# EAGLE schematic Main&MotorBoard_v3 (EAGLE 9.7.0)

## Sheet 1 of 3: Cover
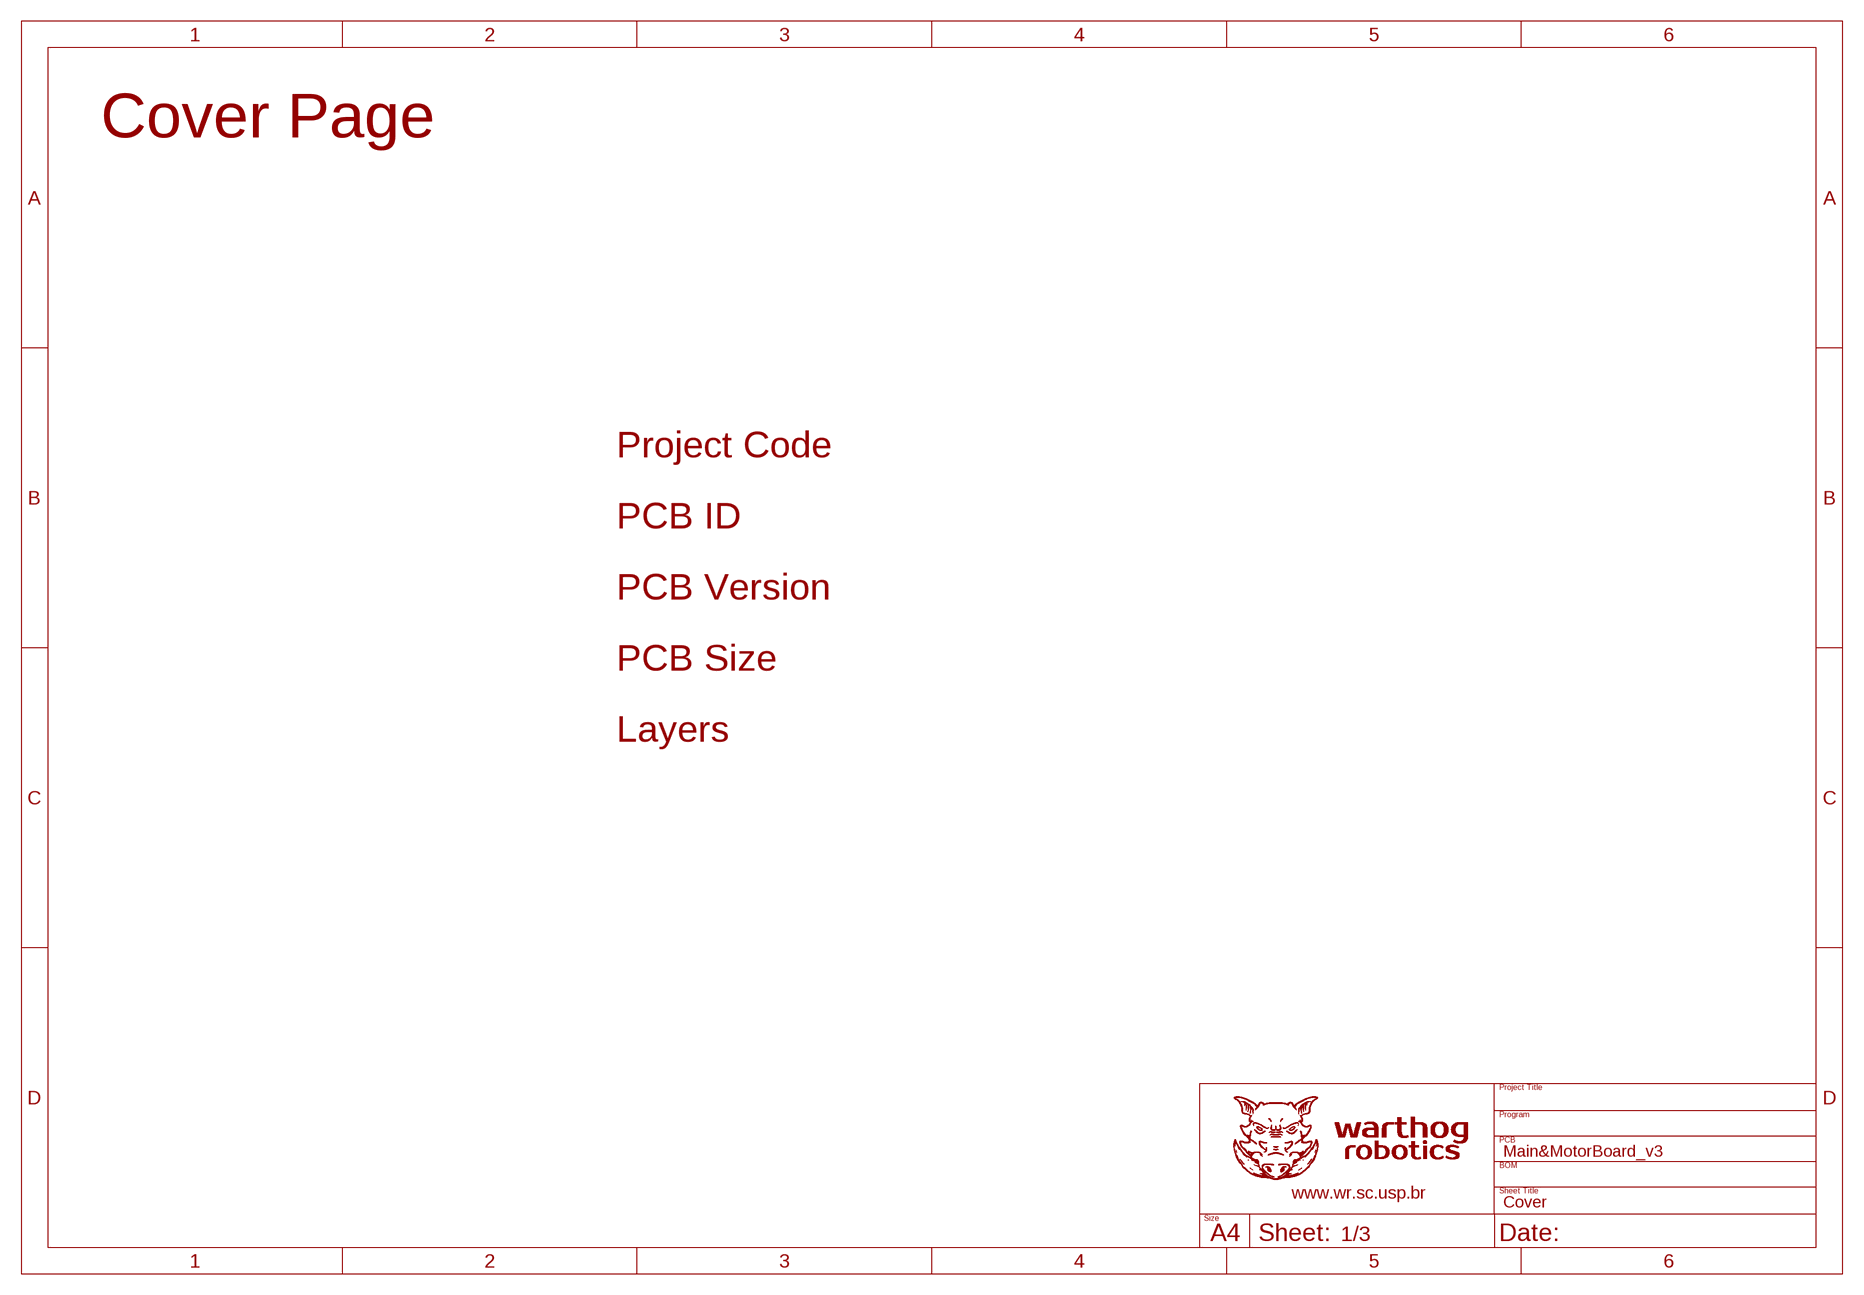
[diagram p0: schematic, sheet 1]

## Sheet 2 of 3: Motor Driver
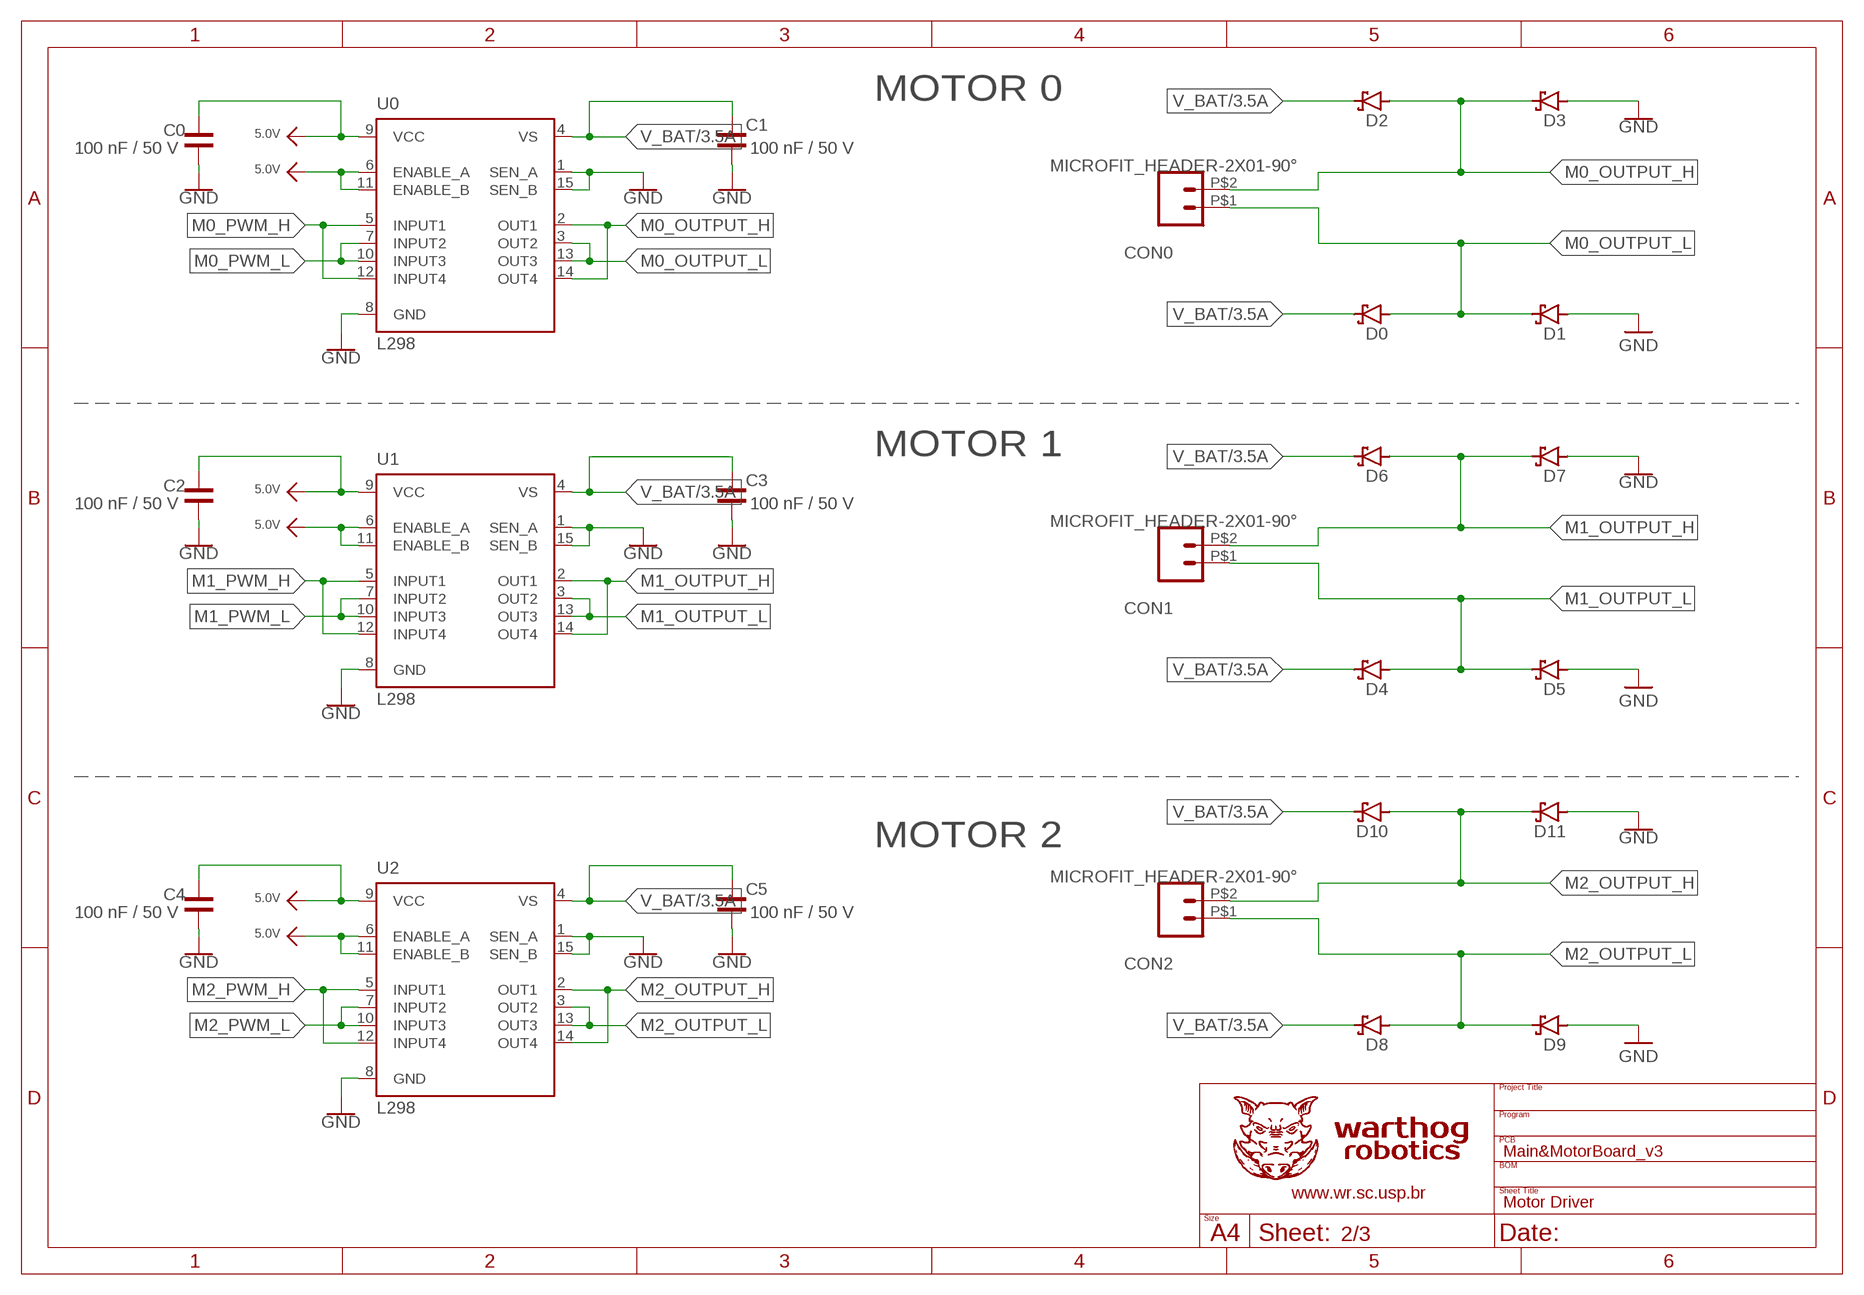
[diagram p1: schematic, sheet 2]

### Parts
C0  100 nF / 50 V  C0805(N)  [C0805(N)]
C1  100 nF / 50 V  C0805(N)  [C0805(N)]
C2  100 nF / 50 V  C0805(N)  [C0805(N)]
C3  100 nF / 50 V  C0805(N)  [C0805(N)]
C4  100 nF / 50 V  C0805(N)  [C0805(N)]
C5  100 nF / 50 V  C0805(N)  [C0805(N)]
CON0  MICROFIT_HEADER-2X01-90°  [2X01-3.00MM-90°]
CON1  MICROFIT_HEADER-2X01-90°  [2X01-3.00MM-90°]
CON2  MICROFIT_HEADER-2X01-90°  [2X01-3.00MM-90°]
D0  1N5406  [DO201-15(N)]
D1  1N5406  [DO201-15(N)]
D2  1N5406  [DO201-15(N)]
D3  1N5406  [DO201-15(N)]
D4  1N5406  [DO201-15(N)]
D5  1N5406  [DO201-15(N)]
D6  1N5406  [DO201-15(N)]
D7  1N5406  [DO201-15(N)]
D8  1N5406  [DO201-15(N)]
D9  1N5406  [DO201-15(N)]
D10  1N5406  [DO201-15(N)]
D11  1N5406  [DO201-15(N)]
U0  L298  [MULTIWATT-15]
U1  L298  [MULTIWATT-15]
U2  L298  [MULTIWATT-15]

### Nets
5.0V: C0.1 C2.1 C4.1 U0.6(ENABLE_A) U0.9(VCC) U0.11(ENABLE_B) U1.6(ENABLE_A) U1.9(VCC) U1.11(ENABLE_B) U2.6(ENABLE_A) U2.9(VCC) U2.11(ENABLE_B) ; also sheet 3
GND: C0.2 C1.2 C2.2 C3.2 C4.2 C5.2 D1.A D3.A D5.A D7.A D9.A D11.A U0.1(SEN_A) U0.8(GND) U0.15(SEN_B) U1.1(SEN_A) U1.8(GND) U1.15(SEN_B) U2.1(SEN_A) U2.8(GND) U2.15(SEN_B) ; also sheet 3
M0_OUTPUT_H: CON0.P$2 D2.A D3.C U0.2(OUT1) U0.14(OUT4)
M0_OUTPUT_L: CON0.P$1 D0.A D1.C U0.3(OUT2) U0.13(OUT3)
M0_PWM_H: U0.5(INPUT1) U0.12(INPUT4)
M0_PWM_L: U0.7(INPUT2) U0.10(INPUT3)
M1_OUTPUT_H: CON1.P$2 D6.A D7.C U1.2(OUT1) U1.14(OUT4)
M1_OUTPUT_L: CON1.P$1 D4.A D5.C U1.3(OUT2) U1.13(OUT3)
M1_PWM_H: U1.5(INPUT1) U1.12(INPUT4)
M1_PWM_L: U1.7(INPUT2) U1.10(INPUT3)
M2_OUTPUT_H: CON2.P$2 D10.A D11.C U2.2(OUT1) U2.14(OUT4)
M2_OUTPUT_L: CON2.P$1 D8.A D9.C U2.3(OUT2) U2.13(OUT3)
M2_PWM_H: U2.5(INPUT1) U2.12(INPUT4)
M2_PWM_L: U2.7(INPUT2) U2.10(INPUT3)
V_BAT: C1.1 C3.1 C5.1 D0.C D2.C D4.C D6.C D8.C D10.C U0.4(VS) U1.4(VS) U2.4(VS) ; also sheet 3

### Notes on the sheet
- MOTOR 0
- MOTOR 1
- MOTOR 2

## Sheet 3 of 3
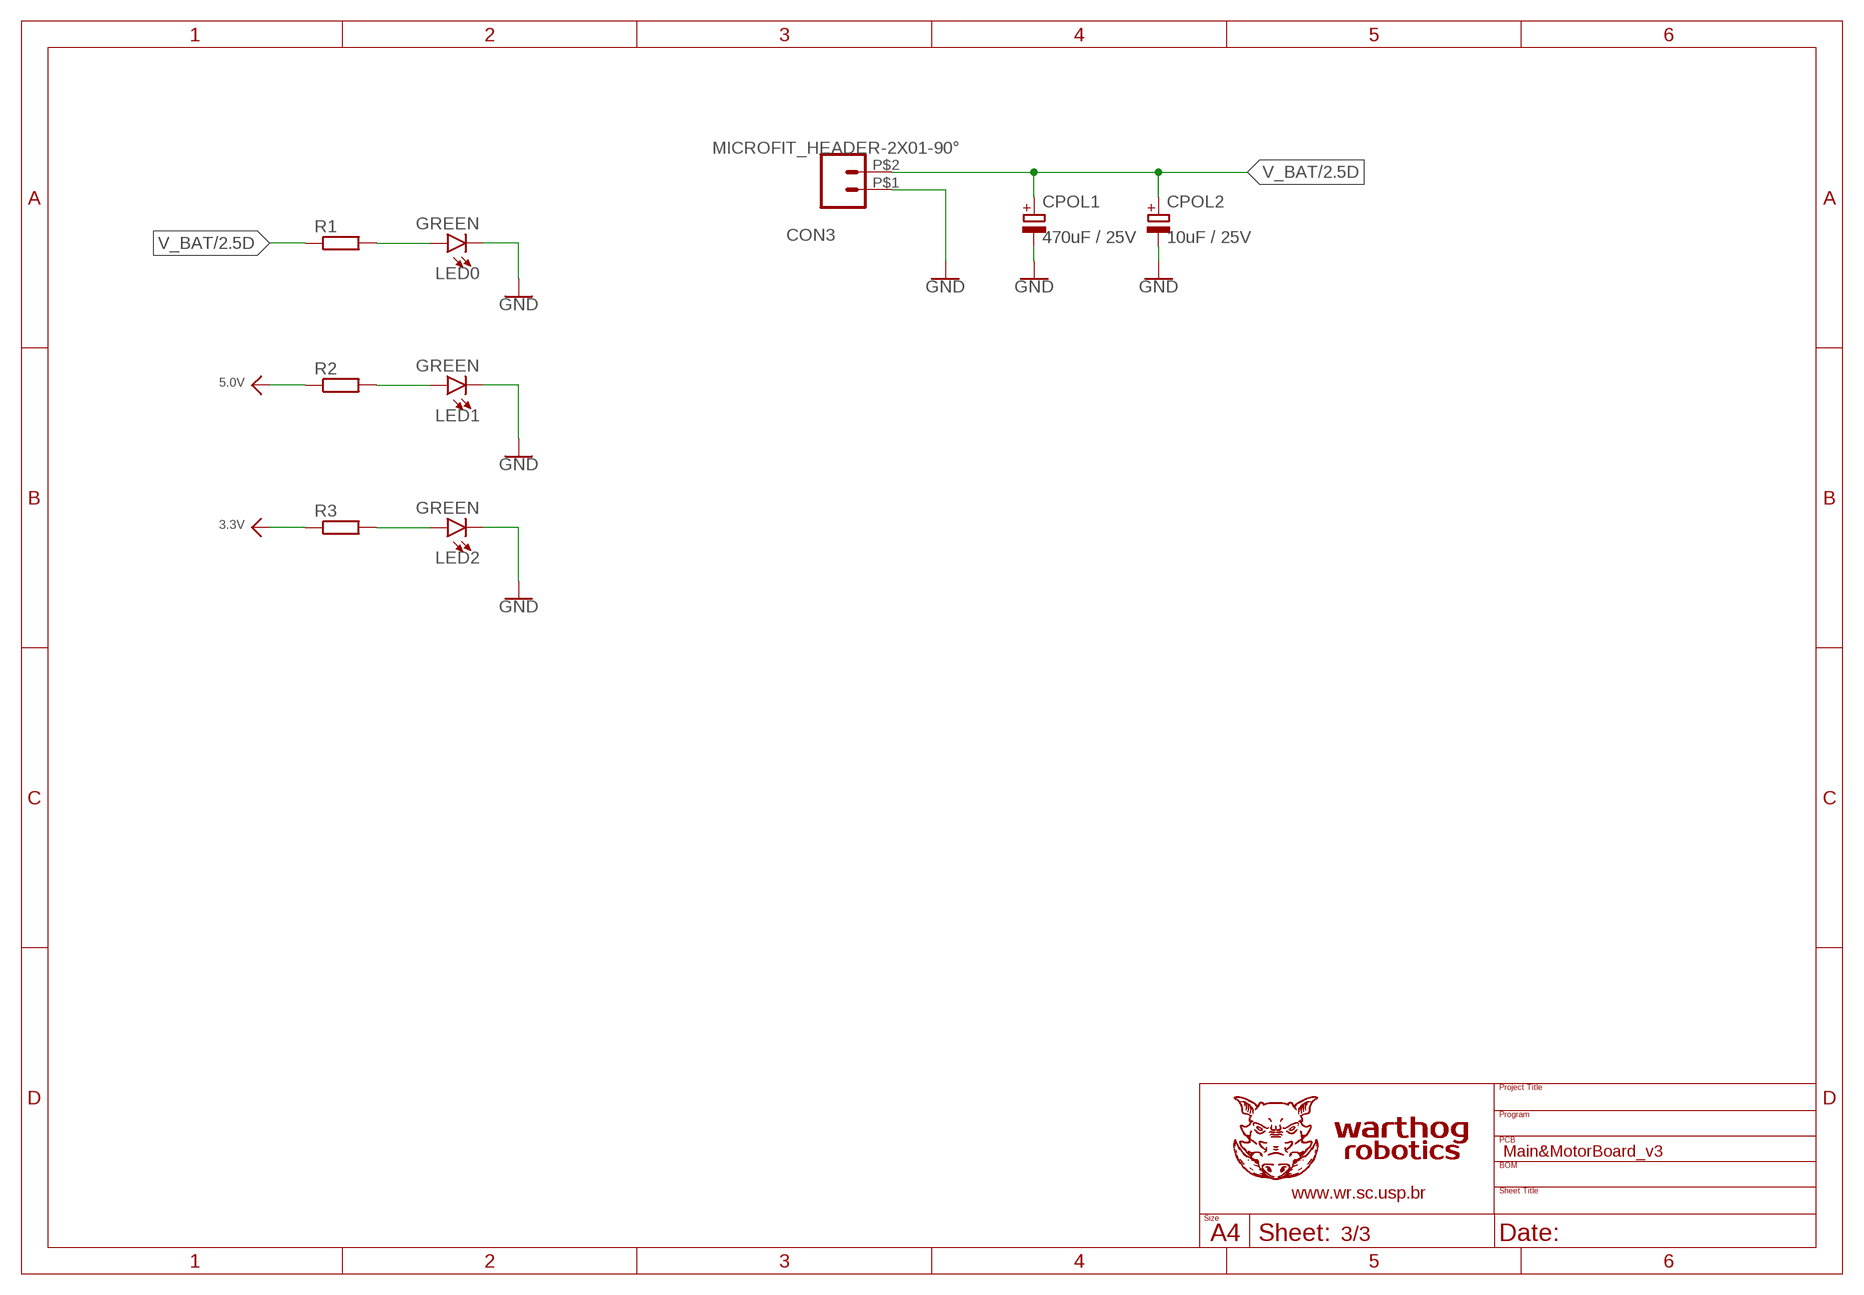
[diagram p2: schematic, sheet 3]

### Parts
CON3  MICROFIT_HEADER-2X01-90°  [2X01-3.00MM-90°]
CPOL1  470uF / 25V  CPOLE7  [OS-CON_E7]
CPOL2  10uF / 25V  CPOLE7  [OS-CON_E7]
LED0  GREEN  LEDSML0402  [SML0402]
LED1  GREEN  LEDSML0402  [SML0402]
LED2  GREEN  LEDSML0402  [SML0402]
R1  RC0603(M)  [C0603(M)]
R2  RC0603(M)  [C0603(M)]
R3  RC0603(M)  [C0603(M)]

### Nets
5.0V: R2.1 R3.1 ; supply symbol labelled 3.3V ; also sheet 2
GND: CON3.P$1 CPOL1.2(-) CPOL2.2(-) LED0.1(C) LED1.1(C) LED2.1(C) ; also sheet 2
N$1: LED0.2(A) R1.2
N$2: LED1.2(A) R2.2
N$3: LED2.2(A) R3.2
V_BAT: CON3.P$2 CPOL1.1(+) CPOL2.1(+) R1.1 ; also sheet 2

## Library data of the parts
C0 C1-C5 = WarthogRobotics-RLC:C
CON0 CON1-CON3 = WarthogRobotics-Connectors:MICROFIT_HEADER-2X01-90°
CPOL1 CPOL2 = WarthogRobotics-RLC:CPOL
D0 D1-D11 = WarthogRobotics-Diodes:1N5406: SCHOTTKY DIODE
LED0 LED1 LED2 = WarthogRobotics-LED:LED
R1-R3 = WarthogRobotics-RLC:R
U0 U1 U2 = st-microelectronics:L298: DUAL FULL-BRIDGE DRIVER; MPN: L298N; OC_FARNELL: 1589425; OC_NEWARK: 32M1527